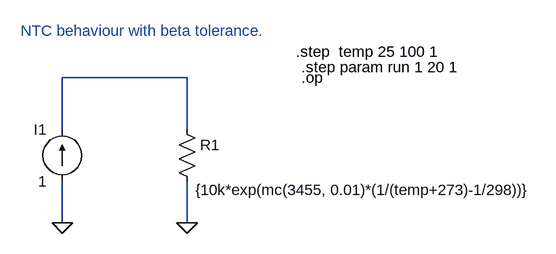
[diagram p0: schematic Draft24.asc]
Draft24.asc, the LTspice schematic file:
Version 4.1
SHEET 1 1000 680
WIRE 208 32 16 32
WIRE 16 112 16 32
WIRE 208 112 208 32
WIRE 16 256 16 192
WIRE 208 256 208 192
FLAG 16 256 0
FLAG 208 256 0
SYMBOL res 192 96 R0
WINDOW 3 29 109 Left 2
SYMATTR InstName R1
SYMATTR Value {10k*exp(mc(3455, 0.01)*(1/(temp+273)-1/298))}
SYMBOL current 16 192 R180
WINDOW 0 24 80 Left 2
WINDOW 3 24 0 Left 2
SYMATTR InstName I1
SYMATTR Value 1
TEXT 376 -8 Left 2 !.step  temp 25 100 1
TEXT 384 32 Left 2 !.op
TEXT 384 16 Left 2 !.step param run 1 20 1
TEXT -48 -40 Left 2 ;NTC behaviour with beta tolerance.

The netlist it stands for:
* Draft24.asc
R1 N001 0 {10k*exp(mc(3455, 0.01)*(1/(temp+273)-1/298))}
I1 0 N001 1
.step  temp 25 100 1
.op
.step param run 1 20 1
* NTC behaviour with beta tolerance.
.backanno
.end